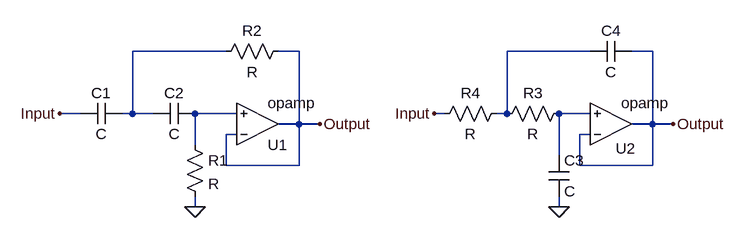
[diagram p0: schematic sallen_key_hp_lp.asc]
sallen_key_hp_lp.asc, the LTspice schematic file:
Version 4
SHEET 1 880 680
WIRE 48 48 -96 48
WIRE 160 48 128 48
WIRE 608 48 480 48
WIRE 704 48 672 48
WIRE -176 144 -208 144
WIRE -96 144 -96 48
WIRE -96 144 -112 144
WIRE -64 144 -96 144
WIRE 64 144 0 144
WIRE 384 144 368 144
WIRE 480 144 480 48
WIRE 480 144 464 144
WIRE 608 144 560 144
WIRE 160 160 160 48
WIRE 160 160 128 160
WIRE 192 160 160 160
WIRE 704 160 704 48
WIRE 704 160 672 160
WIRE 736 160 704 160
WIRE 64 176 48 176
WIRE 608 176 592 176
WIRE 0 192 0 144
WIRE 560 208 560 144
WIRE 48 224 48 176
WIRE 160 224 160 160
WIRE 160 224 48 224
WIRE 592 224 592 176
WIRE 704 224 704 160
WIRE 704 224 592 224
WIRE 0 288 0 272
WIRE 560 288 560 272
FLAG 0 288 0
FLAG -208 144 Input
FLAG 192 160 Output
FLAG 560 288 0
FLAG 368 144 Input
FLAG 736 160 Output
SYMBOL OpAmps\\opamp 96 224 M180
SYMATTR InstName U1
SYMBOL OpAmps\\opamp 640 224 M180
WINDOW 0 7 26 Left 2
SYMATTR InstName U2
SYMBOL cap -112 128 R90
WINDOW 0 0 32 VBottom 2
WINDOW 3 32 32 VTop 2
SYMATTR InstName C1
SYMBOL cap 0 128 R90
WINDOW 0 0 32 VBottom 2
WINDOW 3 32 32 VTop 2
SYMATTR InstName C2
SYMBOL res -16 176 R0
SYMATTR InstName R1
SYMBOL res 144 32 R90
WINDOW 0 0 56 VBottom 2
WINDOW 3 32 56 VTop 2
SYMATTR InstName R2
SYMBOL res 576 128 R90
WINDOW 0 0 56 VBottom 2
WINDOW 3 32 56 VTop 2
SYMATTR InstName R3
SYMBOL res 480 128 R90
WINDOW 0 0 56 VBottom 2
WINDOW 3 32 56 VTop 2
SYMATTR InstName R4
SYMBOL cap 544 208 R0
SYMATTR InstName C3
SYMBOL cap 672 32 R90
WINDOW 0 0 32 VBottom 2
WINDOW 3 32 32 VTop 2
SYMATTR InstName C4

The netlist it stands for:
* sallen_key_hp_lp.asc
XU1 Output N003 Output opamp Aol=100K GBW=10Meg  ; pins invin noninvin out
XU2 Output N004 Output opamp Aol=100K GBW=10Meg  ; pins invin noninvin out
C1 N001 Input C
C2 N003 N001 C
R1 N003 0 R
R2 Output N001 R
R3 N004 N002 R
R4 N002 Input R
C3 N004 0 C
C4 Output N002 C
.backanno
.end